# Altium project Nixie.PrjPcb
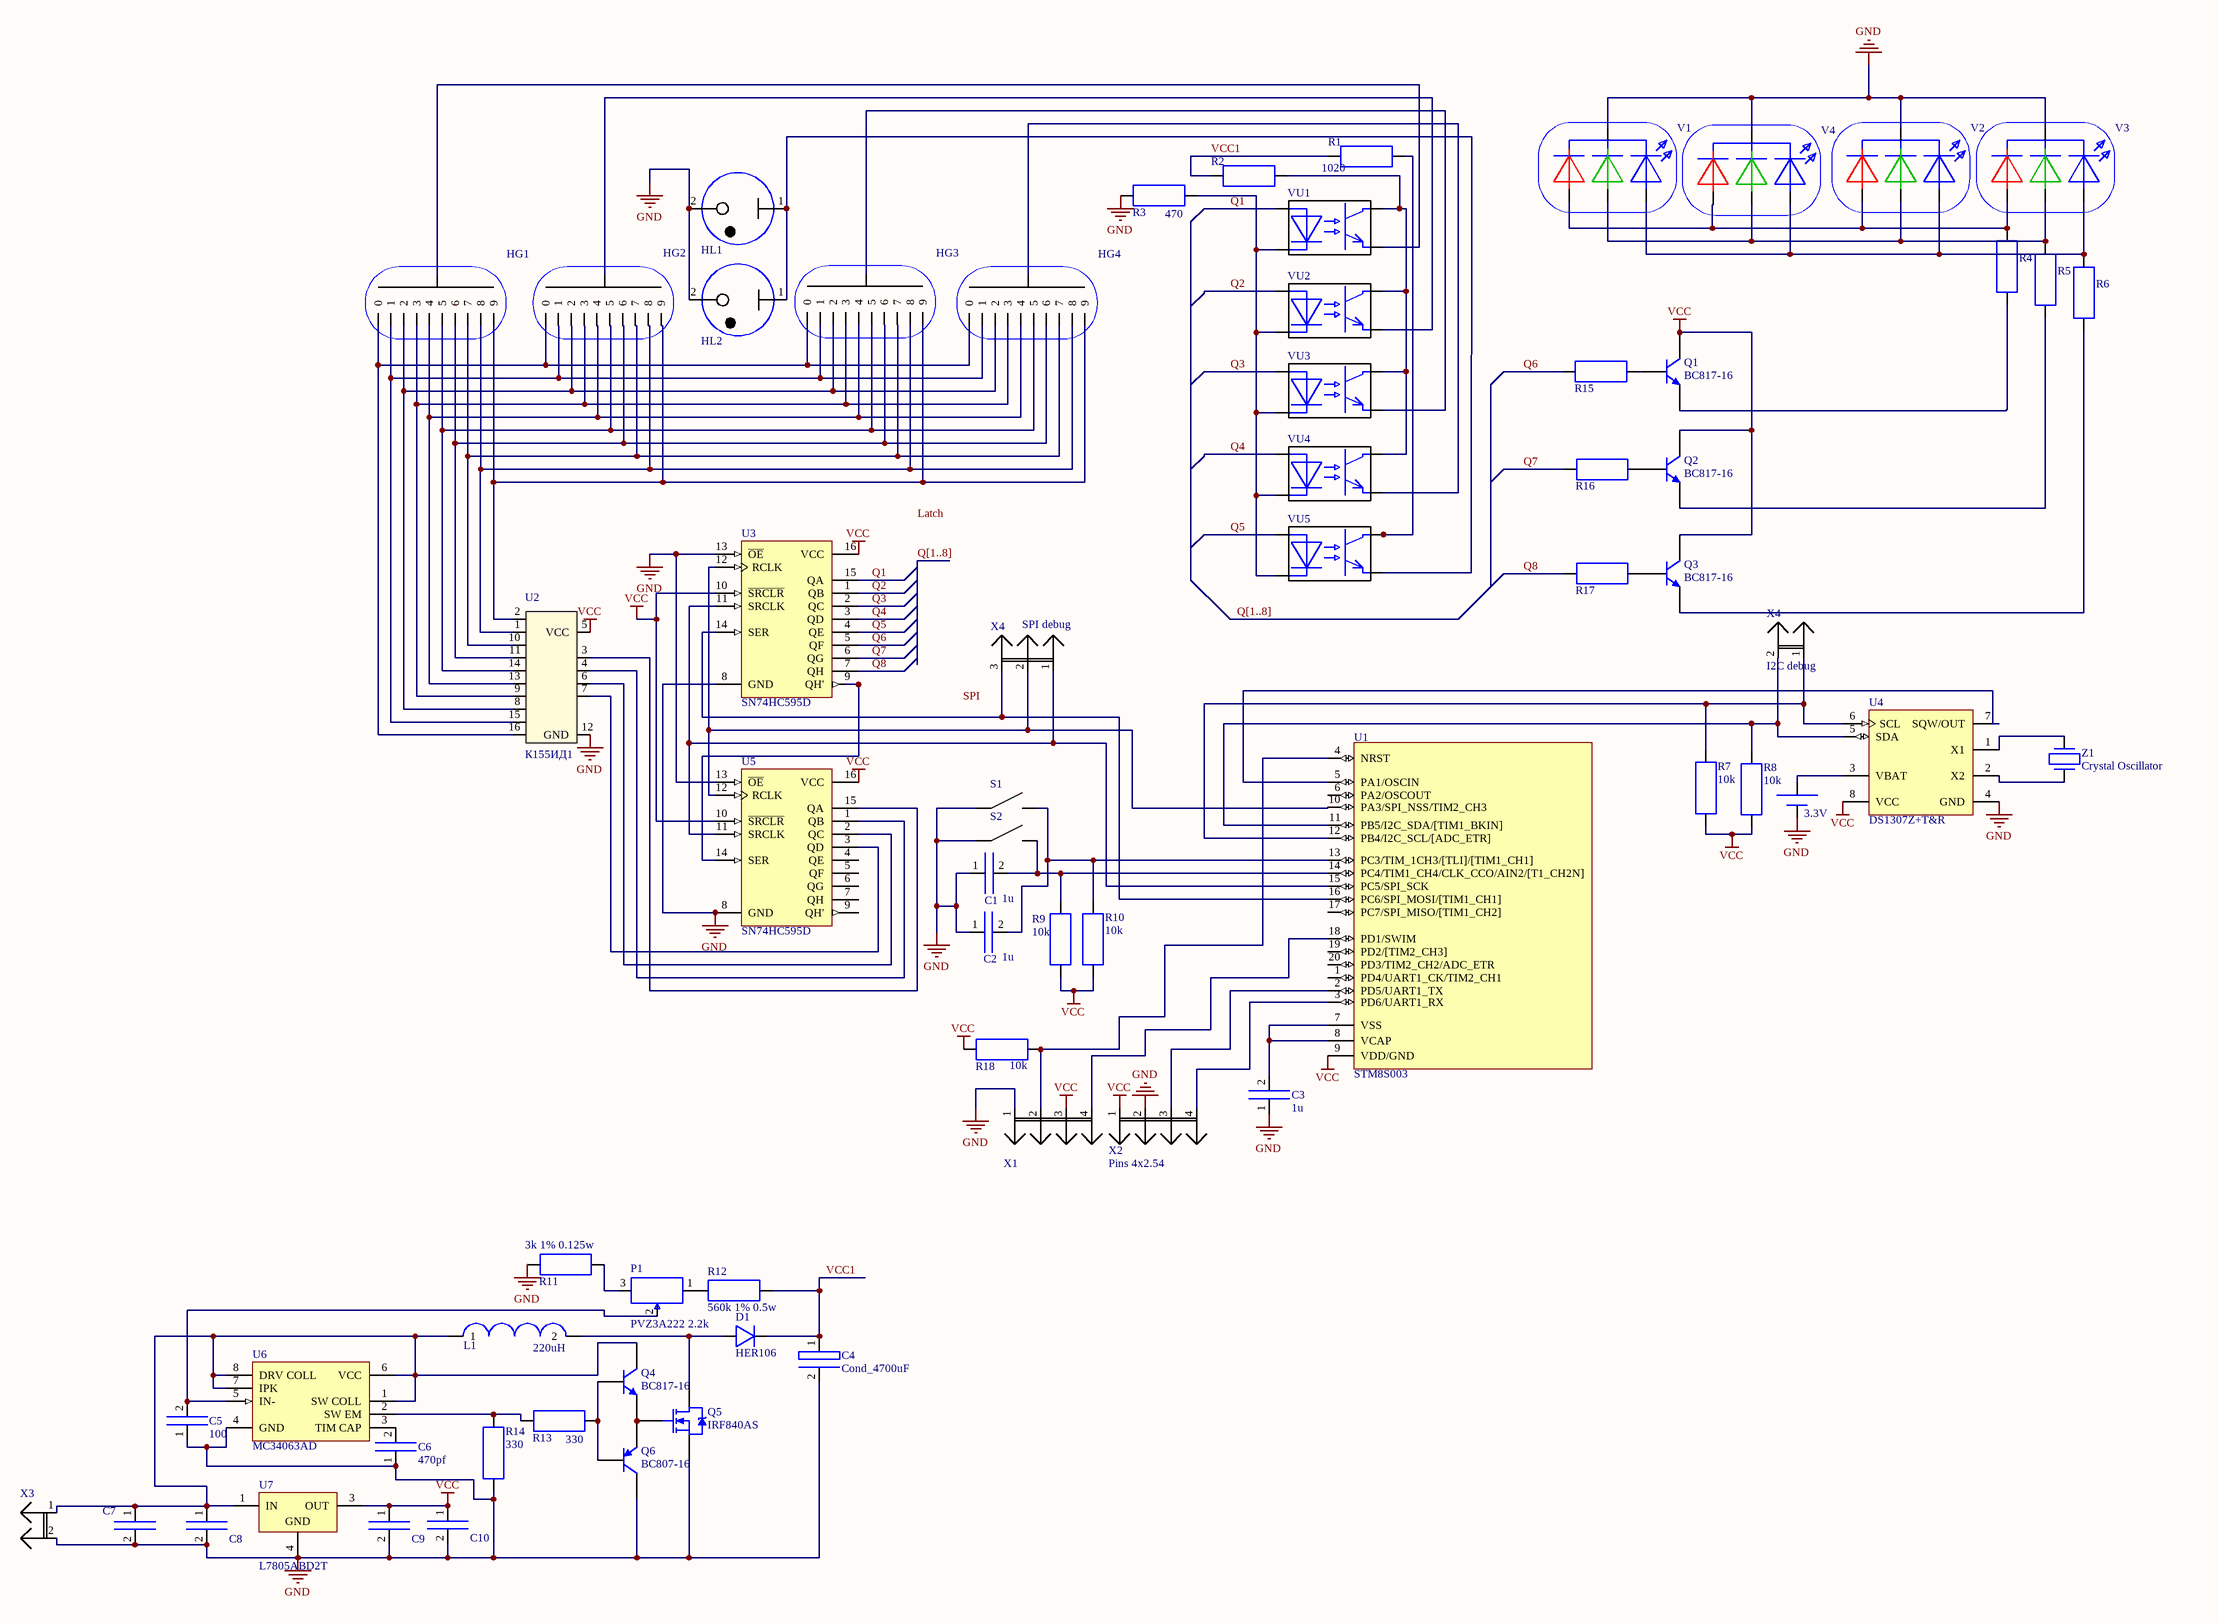
[diagram p0: Scheme.SchDoc]
1 sheet, 68 parts. Net scope: global (net labels, ports and power ports of the same name join across sheets).
Board files: PCB.PcbDoc, Double_side.PcbDoc

## Sheet Scheme.SchDoc
size A2

### Parts
(Parts that share a designator on the sheet are numbered #1, #2 ... from top to bottom, then left to right.)
3.3V  CR2032_Holder_BH-642  [BH-642(CR2032)]  (value not drawn)
C1  1u  [C0805]
C2  1u  [C0805]
C3  1u  [C0805]
C4  Cond_4700uF  [Cond_3*1.27]
C5  100  [C0805]
C6  470pf  [C0805]
C7  Condensator_0805  [C0805]  (value not drawn)
C8  Condensator_0805  [C0805]  (value not drawn)
C9  Condensator_0805  [C0805]  (value not drawn)
C10  Condensator_0805  [C0805]  (value not drawn)
D1  HER106  [DO-41]
HG1  ИН-12  [ИН-12]  (value not drawn)
HG2  ИН-12  [ИН-12]  (value not drawn)
HG3  ИН-12  [ИН-12]  (value not drawn)
HG4  ИН-12  [ИН-12]  (value not drawn)
HL1  ИНС-1  [INS-1]  (value not drawn)
HL2  ИНС-1  [INS-1]  (value not drawn)
L1  220uH  [SRR1208]
P1  PVZ3A222 2.2k  [PVZ3A222]
Q1  BC817-16  [SOT23_N]
Q2  BC817-16  [SOT23_N]
Q3  BC817-16  [SOT23_N]
Q4  BC817-16  [SOT23_N]
Q5  IRF840AS  [D2PAK_N]
Q6  BC807-16  [SOT23_N]
R1  1020  [R0805]
R2  Resistor  [R0805]  (value not drawn)
R3  470  [R0805]
R4  Resistor  [R0805]  (value not drawn)
R5  Resistor  [R0805]  (value not drawn)
R6  Resistor  [R0805]  (value not drawn)
R7  10k  [R0805]
R8  10k  [R0805]
R9  10k  [R0805]
R10  10k  [R0805]
R11  3k 1% 0.125w  [R0805]
R12  560k 1% 0.5w  [R2512]
R13  330  [R0805]
R14  330  [R0805]
R15  Resistor  [R0805]  (value not drawn)
R16  Resistor  [R0805]  (value not drawn)
R17  Resistor  [R0805]  (value not drawn)
R18  10k  [R0805]
S1  Tact_switch  [Pins 2x2.54]  (value not drawn)
S2  Tact_switch  [Pins 2x2.54]  (value not drawn)
U1  STM8S003  [STM8S003_TSOP20]
U2  К155ИД1  [К155ИД1]
U3  SN74HC595D  [D016_N]
U4  DS1307Z+T&R  [S8+2_N]
U5  SN74HC595D  [D016_N]
U6  MC34063AD  [751-05_N]
U7  L7805ABD2T  [TO-263]
V1  RGB_Diod  [RGB]  (value not drawn)
V2  RGB_Diod  [RGB]  (value not drawn)
V3  RGB_Diod  [RGB]  (value not drawn)
V4  RGB_Diod  [RGB]  (value not drawn)
VU1  Optopara_TLP627  [Optopara_TLP627]  (value not drawn)
VU2  Optopara_TLP627  [Optopara_TLP627]  (value not drawn)
VU3  Optopara_TLP627  [Optopara_TLP627]  (value not drawn)
VU4  Optopara_TLP627  [Optopara_TLP627]  (value not drawn)
VU5  Optopara_TLP627  [Optopara_TLP627]  (value not drawn)
X1  Pins 4x2.54  [Pins 4x2.54]  (value not drawn)
X2  Pins 4x2.54  [Pins 4x2.54]
X3  Pins 2x2.54  [Pins 2x2.54]  (value not drawn)
X4#1  I2C debug  [Pins 2x2.54]
X4#2  SPI debug  [Pins 3x2.54]
Z1  Crystal Oscillator  [Geyer KX - 327S 32.768kHz]

### Nets
GND: 3.3V.1 C1.1 C2.1 C3.1 C4.2 C5.1 C6.1 C7.2 C8.2 C9.2 C10.2 HL1.2 HL2.2 Q5.3(S) Q6.3(C) R3.1 R11.1 R14.1 S1.1 S2.1 U2.12(GND) U3.8(GND) U3.13(~{OE}) U4.4(GND) U5.8(GND) U5.13(~{OE}) U6.4(GND) U7.4(GND) V1.3 V2.3 V3.3 V4.3 X1.1 X2.2 X3.2
VCC: C9.1 C10.1 Q1.3(C) Q2.3(C) Q3.3(C) R7.1 R8.1 R9.1 R10.1 R18.1 U1.9(VDD/GND) U2.5(VCC) U3.10(~{SRCLR}) U3.16(VCC) U4.8(VCC) U5.10(~{SRCLR}) U5.16(VCC) U7.3(OUT) X1.3 X2.1
Q1: U3.15(QA) VU1.1
Q2: U3.1(QB) VU2.1
Q3: U3.2(QC) VU3.1
Q4: U3.3(QD) VU4.1
Q5: U3.4(QE) VU5.1
Q6: R15.1 U3.5(QF)
Q7: R16.1 U3.6(QG)
Q8: R17.1 U3.7(QH)
VCC1: C4.1 D1.2 R1.1 R2.1 R12.1
Net3.3V_2: 3.3V.2 U4.3(VBAT)
NetC1_2: C1.2 R9.2 S2.2 U1.14(PC4/TIM1_CH4/CLK_CCO/AIN2/[T1_CH2N])
NetC2_2: C2.2 R10.2 S1.2 U1.13(PC3/TIM_1CH3/[TLI]/[TIM1_CH1])
NetC3_2: C3.2 U1.7(VSS) U1.8(VCAP)
NetC5_2: C5.2 P1.2 U6.5(IN-)
NetC6_2: C6.2 U6.3(TIM_CAP)
NetC7_1: C7.1 C8.1 L1.1 Q4.3(C) U6.1(SW_COLL) U6.6(VCC) U6.7(IPK) U6.8(DRV_COLL) U7.1(IN) X3.1
NetD1_1: D1.1 L1.2 Q5.2(D)
NetHG1_1: HG1.1(A) VU1.3
NetHG1_2: HG1.2(0) HG2.2(0) HG3.2(0) HG4.2(0) U2.16
NetHG1_3: HG1.3(9) HG2.3(9) HG3.3(9) HG4.3(9) U2.2
NetHG1_4: HG1.4(8) HG2.4(8) HG3.4(8) HG4.4(8) U2.1
NetHG1_5: HG1.5(7) HG2.5(7) HG3.5(7) HG4.5(7) U2.10
NetHG1_6: HG1.6 HG2.6 HG3.6 HG4.6 U2.11
NetHG1_7: HG1.7(5) HG2.7(5) HG3.7(5) HG4.7(5) U2.14
NetHG1_8: HG1.8(4) HG2.8(4) HG3.8(4) HG4.8(4) U2.13
NetHG1_9: HG1.9(3) HG2.9(3) HG3.9(3) HG4.9(3) U2.9
NetHG1_10: HG1.10(2) HG2.10(2) HG3.10(2) HG4.10(2) U2.8
NetHG1_11: HG1.11(1) HG2.11(1) HG3.11(1) HG4.11(1) U2.15
NetHG2_1: HG2.1(A) VU2.3
NetHG3_1: HG3.1(A) VU3.3
NetHG4_1: HG4.1(A) VU4.3
NetHL1_1: HL1.1 HL2.1 VU5.3
NetP1_1: P1.1 R12.2
NetP1_3: P1.3 R11.2
NetQ1_1: Q1.1(B) R15.2
NetQ1_2: Q1.2(E) R4.1
NetQ2_1: Q2.1(B) R16.2
NetQ2_2: Q2.2(E) R5.1
NetQ3_1: Q3.1(B) R17.2
NetQ3_2: Q3.2(E) R6.1
NetQ4_1: Q4.1(B) Q6.1(B) R13.2
NetQ4_2: Q4.2(E) Q5.1(G) Q6.2(E)
NetR1_2: R1.2 VU5.4
NetR2_2: R2.2 VU1.4 VU2.4 VU3.4 VU4.4
NetR3_2: R3.2 VU1.2 VU2.2 VU3.2 VU4.2 VU5.2
NetR4_2: R4.2 V1.4 V2.4 V3.4 V4.4
NetR5_2: R5.2 V1.1 V2.1 V3.1 V4.1
NetR6_2: R6.2 V1.2 V2.2 V3.2 V4.2
NetR7_2: R7.2 U1.12(PB4/I2C_SCL/[ADC_ETR]) U4.6(SCL) X4#1.1
NetR8_2: R8.2 U1.11(PB5/I2C_SDA/[TIM1_BKIN]) U4.5(SDA) X4#1.2
NetR13_1: R13.1 R14.2 U6.2(SW_EM)
NetR18_2: R18.2 U1.4(NRST) X1.2
NetU1_2: U1.2(PD5/UART1_TX) X2.3
NetU1_3: U1.3(PD6/UART1_RX) X2.4
NetU1_5: U1.5(PA1/OSCIN) U4.7(SQW/OUT)
NetU1_10: U1.10(PA3/SPI_NSS/TIM2_CH3) U3.12(RCLK) U5.12(RCLK) X4#2.2
NetU1_15: U1.15(PC5/SPI_SCK) U3.11(SRCLK) U5.11(SRCLK) X4#2.1
NetU1_16: U1.16(PC6/SPI_MOSI/[TIM1_CH1]) U3.14(SER) X4#2.3
NetU1_18: U1.18(PD1/SWIM) X1.4
NetU2_3: U2.3 U5.15(QA)
NetU2_4: U2.4 U5.1(QB)
NetU2_6: U2.6 U5.2(QC)
NetU2_7: U2.7 U5.3(QD)
NetU3_9: U3.9(QH') U5.14(SER)
NetU4_1: U4.1(X1) Z1.1
NetU4_2: U4.2(X2) Z1.2

Not connected (* = marked no-connect by the designer): U1 1(PD4/UART1_CK/TIM2_CH1) 6(PA2/OSCOUT) 17(PC7/SPI_MISO/[TIM1_CH2]) 19(PD2/[TIM2_CH3]) 20(PD3/TIM2_CH2/ADC_ETR); U5 4(QE) 5(QF) 6(QG) 7(QH) 9(QH')

### Buses and harness runs
bus Q[1..8]

### Notes on the sheet
- Labels drawn without touching a wire or pin: Latch, SPI

### Library data of the parts
C1-C3 C5 C6 = Condensator_0805
D1 = Diod
L1 = Inductance
P1 = Podstroechnik
Q1-Q4 = BC817-16: NPN General-purpose Transistor; Published: 17-Sep-2003; LatestRevisionDate: 12-Dec-2006; LatestRevisionNote: IPC-7351 Footprint Added.; DatasheetVersion: Jun-1999; PackageVersion: May-1999; PackageReference: SOT23; Publisher: Altium Limited; PackageDescription: 3-Pin SOT-23 Package 0.95 mm Pitch, 2.3 mm Lead Span; ComponentLink1Description: Manufacturer Link; ComponentLink1URL: http://www.semiconductors.philips.com/; ComponentLink2Description: Datasheet; ComponentLink2URL: http://www.semiconductors.philips.com/acrobat/datasheets/BC817_BC817W_BC337_5.pdf
Q5 = IRF840AS: HEXFET Power MOSFET; Published: 17-Sep-2003; LatestRevisionDate: 20-Nov-2009; LatestRevisionNote: IPC-7351 Footprint Added.; DatasheetVersion: 16-Dec-1999; PackageReference: D2PAK; Publisher: Altium Limited; PackageDescription: 3-Pin Transistor Outline Package 2.54 mm Pitch, 15.1 mm Lead Span; ComponentLink1Description: Manufacturer Link; ComponentLink1URL: http://www.irf.com/; ComponentLink2Description: Datasheet; ComponentLink2URL: http://www.irf.com/product-info/datasheets/data/IRLP3803.pdf
Q6 = BC807-16: PNP General-purpose Transistor; Published: 17-Sep-2003; LatestRevisionDate: 12-Dec-2006; LatestRevisionNote: IPC-7351 Footprint Added.; DatasheetVersion: 8-Apr-1999; PackageVersion: May-1999; PackageReference: SOT23; Publisher: Altium Limited; PackageDescription: 3-Pin SOT-23 Package 0.95 mm Pitch, 2.3 mm Lead Span; ComponentLink1Description: Manufacturer Link; ComponentLink1URL: http://www.semiconductors.philips.com/; ComponentLink2Description: Datasheet; ComponentLink2URL: http://www.semiconductors.philips.com/acrobat/datasheets/BC807_BC807W_BC327_5.pdf
R1 R3 R7-R14 R18 = Resistor
U3 U5 = SN74HC595D: 8-Bit Shift Register with 3-State Output Registers; Published: 8-Jun-2000; LatestRevisionDate: 13-Apr-2006; LatestRevisionNote: IPC-7351 Footprint Added.; DatasheetVersion: May-1997; PackageVersion: Jan-1998; PackageReference: D016; Publisher: Altium Limited; PackageDescription: 16-Pin Small Outline Integrated Circuit 1.27 mm Pitch; Code_IPC: SOIC127P600-16; ComponentLink1Description: Manufacturer Link; ComponentLink1URL: http://www.ti.com/; ComponentLink2Description: Datasheet; ComponentLink2URL: http://www-s.ti.com/sc/ds/sn74hc595.pdf
U4 = DS1307Z+T&R: 64 x 8, Serial, I2C Real-Time Clock, 5.0V, 8-Pin SO, 0 to 70 degC, Pb-Free, Reel; DatasheetVersion: 10-Feb-2008; PackageVersion: revC, 2010; PackageReference: S8+2; PackageDescription: 8-Pin Small-Outline IC, Narrow (0.15in), 1.27 mm Pitch, SOIC (N), Pb-Free; Code_JEDEC: MS-012-AA; Code_IPC: SOIC127P600-8; ComponentLink1Description: Manufacturer URL; ComponentLink1URL: http://www.maxim-ic.com; ComponentLink2Description: Datasheet; ComponentLink2URL: http://datasheets.maxim-ic.com/en/ds/DS1307.pdf; ComponentLink3Description: Package Specification; ComponentLink3URL: http://pdfserv.maxim-ic.com/package_dwgs/21-0041.PDF
U6 = MC34063AD: DC-to-DC Converter Control Circuit; Published: 15-Apr-2002; LatestRevisionDate: 13-Apr-2006; LatestRevisionNote: IPC-7351 Footprint Added.; DatasheetVersion: 1996; PackageVersion: 1998; PackageReference: 751-05; Publisher: Altium Limited; PackageDescription: 8-Pin Small Outline Integrated Circuit 1.27 mm Pitch; Code_JEDEC: MS-012-AA; Code_IPC: SOIC127P600-8; ComponentLink1Description: Manufacturer Link; ComponentLink1URL: http://www.onsemi.com/site/products/taxonomy/0,4438,503,00.html; ComponentLink2Description: Datasheet; ComponentLink2URL: http://www.onsemi.com/pub/Collateral/MC34063A-D.PDF
U7 = L7805ABD2T: Precision 1A Regulator; Published: 24-Aug-2001; LatestRevisionDate: 17-Jul-2002; LatestRevisionNote: Re-released for DXP Platform.; DatasheetVersion: Nov-1999; PackageReference: TO-263; Publisher: Altium Limited; PackageDescription: D2-PAK/TO-263-AB; 3 Leads (1 Cropped); Body 15.9 (inc. leads) x 10.4 mm (LxW max); ComponentLink1Description: Manufacturer Link; ComponentLink1URL: http://www.st.com/; ComponentLink2Description: Datasheet; ComponentLink2URL: http://www.st.com/stonline/products/literature/ds/2144/l7805ab.pdf
X4#1 = Pins 2x2.54
X4#2 = Pins 3x2.54